# Altium schematic sheet data.SchDoc
size 297 x 209 mm
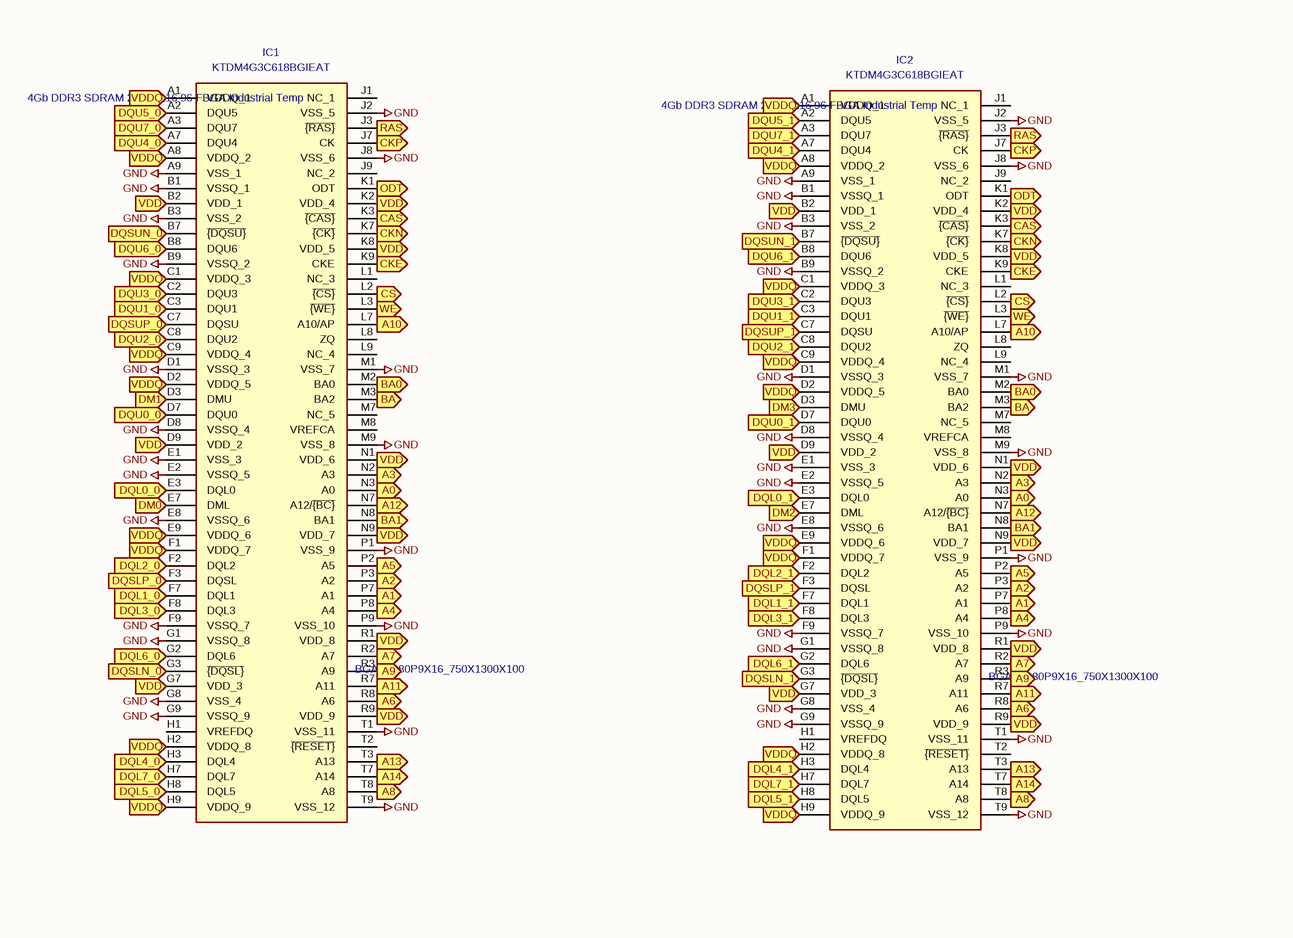
[diagram p0: data.SchDoc, top]
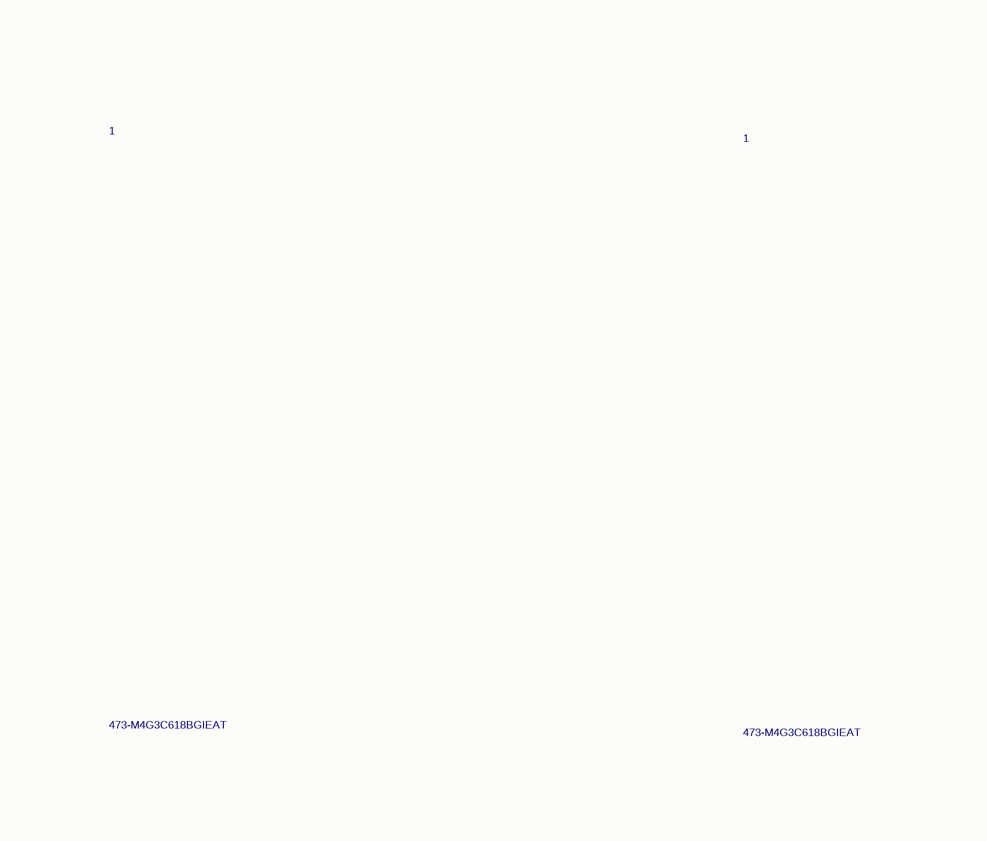
[diagram p1: data.SchDoc, centre]
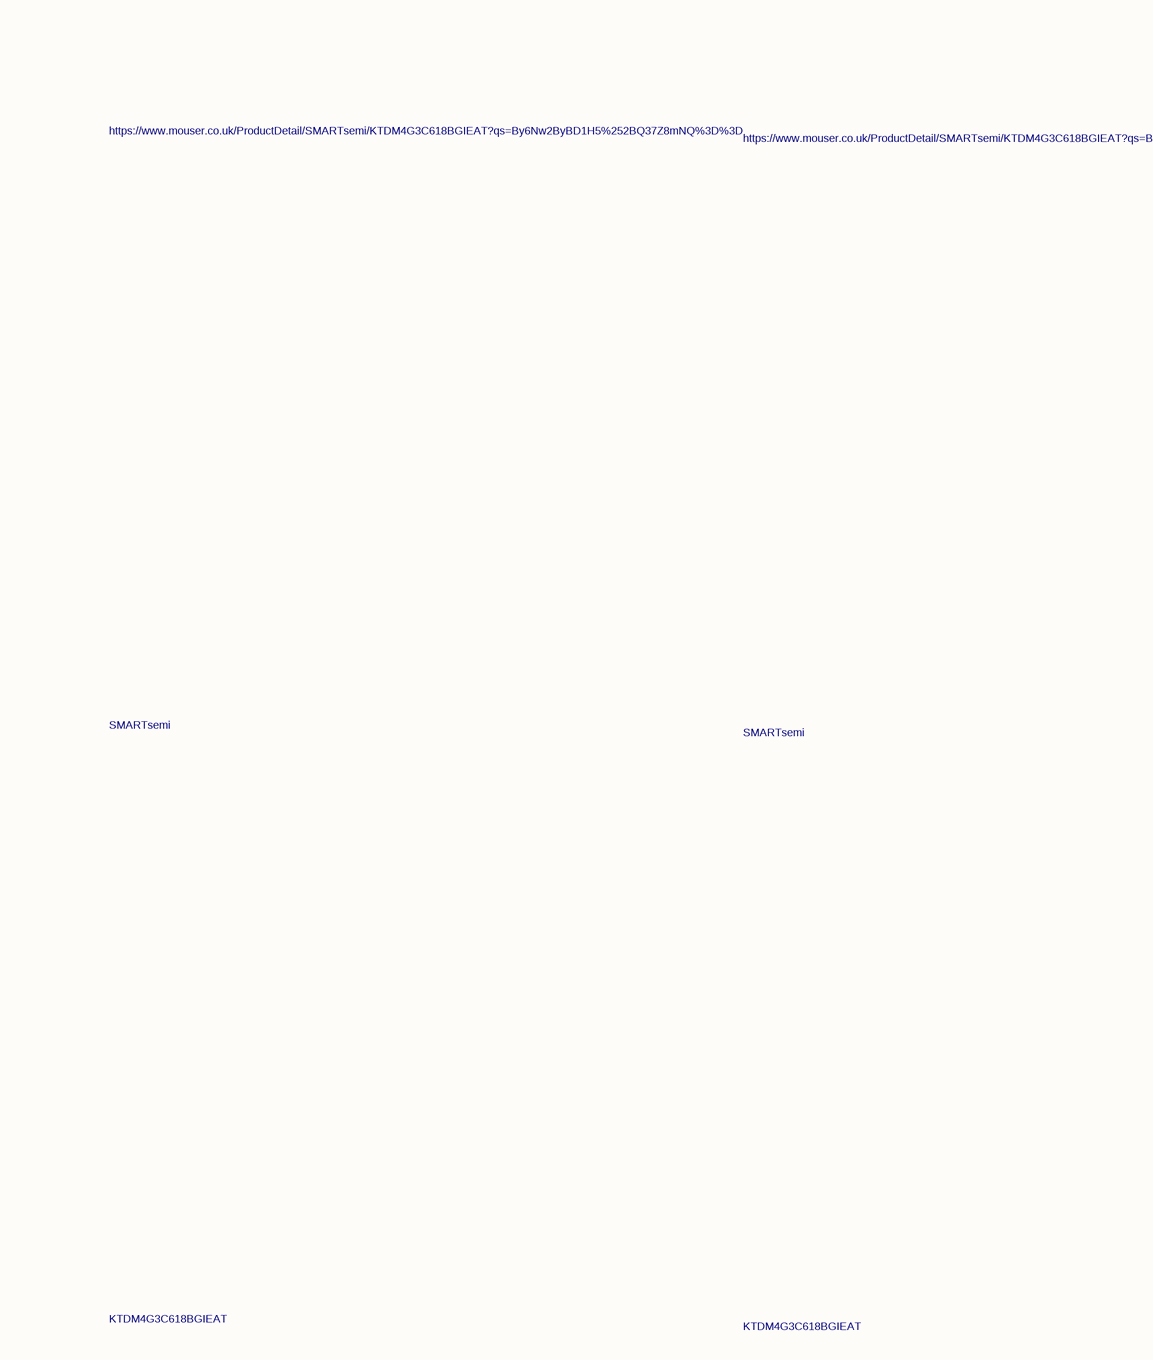
[diagram p2: data.SchDoc, bottom]

## Parts
IC1  Description: 4Gb DDR3 SDRAM 256Mbx16 96-FBGA Industrial Temp  Height: 1  Mouser Part Number: 473-M4G3C618BGIEAT  Manufacturer_Name: SMARTsemi  [BGA96C80P9X16_750X1300X100]  (hidden comment: KTDM4G3C618BGIEAT)
IC2  Description: 4Gb DDR3 SDRAM 256Mbx16 96-FBGA Industrial Temp  Height: 1  Mouser Part Number: 473-M4G3C618BGIEAT  Manufacturer_Name: SMARTsemi  [BGA96C80P9X16_750X1300X100]  (hidden comment: KTDM4G3C618BGIEAT)

## Ports
A0 (in), A1 (in), A2 (in), A3 (in), A4 (in), A5 (in), A6 (in), A7 (in), A8 (in), A9 (in), A10 (in), A11 (in), A12 (in), A13 (in), A14 (in), BA0 (in), BA1 (in), BA (in), CAS (in), CKE (in), CKN (in), CKP (in), CS (in), DM0 (in), DM1 (in), DM2 (in), DM3 (in), DQL0_0 (in), DQL0_1 (in), DQL1_0 (in), DQL1_1 (in), DQL2_0 (in), DQL2_1 (in), DQL3_0 (in), DQL3_1 (in), DQL4_0 (in), DQL4_1 (in), DQL5_0 (in), DQL5_1 (in), DQL6_0 (in), DQL6_1 (in), DQL7_0 (in), DQL7_1 (in), DQSLN_0 (in), DQSLN_1 (in), DQSLP_0 (in), DQSLP_1 (in), DQSUN_0 (in), DQSUN_1 (in), DQSUP_0 (in), DQSUP_1 (in), DQU0_0 (in), DQU0_1 (in), DQU1_0 (in), DQU1_1 (in), DQU2_0 (in), DQU2_1 (in), DQU3_0 (in), DQU3_1 (in), DQU4_0 (in), DQU4_1 (in), DQU5_0 (in), DQU5_1 (in), DQU6_0 (in), DQU6_1 (in), DQU7_0 (in), DQU7_1 (in), ODT (in), RAS (in), VDD (in), VDDQ (in), WE (in)

## Nets
GND: IC1.A9(VSS_1) IC1.B1(VSSQ_1) IC1.B3(VSS_2) IC1.B9(VSSQ_2) IC1.D1(VSSQ_3) IC1.D8(VSSQ_4) IC1.E1(VSS_3) IC1.E2(VSSQ_5) IC1.E8(VSSQ_6) IC1.F9(VSSQ_7) IC1.G1(VSSQ_8) IC1.G8(VSS_4) IC1.G9(VSSQ_9) IC1.J2(VSS_5) IC1.J8(VSS_6) IC1.M1(VSS_7) IC1.M9(VSS_8) IC1.P1(VSS_9) IC1.P9(VSS_10) IC1.T1(VSS_11) IC1.T9(VSS_12) IC2.A9(VSS_1) IC2.B1(VSSQ_1) IC2.B3(VSS_2) IC2.B9(VSSQ_2) IC2.D1(VSSQ_3) IC2.D8(VSSQ_4) IC2.E1(VSS_3) IC2.E2(VSSQ_5) IC2.E8(VSSQ_6) IC2.F9(VSSQ_7) IC2.G1(VSSQ_8) IC2.G8(VSS_4) IC2.G9(VSSQ_9) IC2.J2(VSS_5) IC2.J8(VSS_6) IC2.M1(VSS_7) IC2.M9(VSS_8) IC2.P1(VSS_9) IC2.P9(VSS_10) IC2.T1(VSS_11) IC2.T9(VSS_12)
A0: IC1.N3(A0) IC2.N3(A0) ; port A0
A1: IC1.P7(A1) IC2.P7(A1) ; port A1
A2: IC1.P3(A2) IC2.P3(A2) ; port A2
A3: IC1.N2(A3) IC2.N2(A3) ; port A3
A4: IC1.P8(A4) IC2.P8(A4) ; port A4
A5: IC1.P2(A5) IC2.P2(A5) ; port A5
A6: IC1.R8(A6) IC2.R8(A6) ; port A6
A7: IC1.R2(A7) IC2.R2(A7) ; port A7
A8: IC1.T8(A8) IC2.T8(A8) ; port A8
A9: IC1.R3(A9) IC2.R3(A9) ; port A9
A10: IC1.L7(A10/AP) IC2.L7(A10/AP) ; port A10
A11: IC1.R7(A11) IC2.R7(A11) ; port A11
A12: IC1.N7(A12/~{{BC}}) IC2.N7(A12/~{{BC}}) ; port A12
A13: IC1.T3(A13) IC2.T3(A13) ; port A13
A14: IC1.T7(A14) IC2.T7(A14) ; port A14
BA: IC1.M3(BA2) IC2.M3(BA2) ; port BA
BA0: IC1.M2(BA0) IC2.M2(BA0) ; port BA0
BA1: IC1.N8(BA1) IC2.N8(BA1) ; port BA1
CAS: IC1.K3(~{{CAS}}) IC2.K3(~{{CAS}}) ; port CAS
CKE: IC1.K9(CKE) IC2.K9(CKE) ; port CKE
CKN: IC1.K7(~{{CK}}) IC2.K7(~{{CK}}) ; port CKN
CKP: IC1.J7(CK) IC2.J7(CK) ; port CKP
CS: IC1.L2(~{{CS}}) IC2.L2(~{{CS}}) ; port CS
DM0: IC1.E7(DML) ; port DM0
DM1: IC1.D3(DMU) ; port DM1
DM2: IC2.E7(DML) ; port DM2
DM3: IC2.D3(DMU) ; port DM3
DQL0_0: IC1.E3(DQL0) ; port DQL0_0
DQL0_1: IC2.E3(DQL0) ; port DQL0_1
DQL1_0: IC1.F7(DQL1) ; port DQL1_0
DQL1_1: IC2.F7(DQL1) ; port DQL1_1
DQL2_0: IC1.F2(DQL2) ; port DQL2_0
DQL2_1: IC2.F2(DQL2) ; port DQL2_1
DQL3_0: IC1.F8(DQL3) ; port DQL3_0
DQL3_1: IC2.F8(DQL3) ; port DQL3_1
DQL4_0: IC1.H3(DQL4) ; port DQL4_0
DQL4_1: IC2.H3(DQL4) ; port DQL4_1
DQL5_0: IC1.H8(DQL5) ; port DQL5_0
DQL5_1: IC2.H8(DQL5) ; port DQL5_1
DQL6_0: IC1.G2(DQL6) ; port DQL6_0
DQL6_1: IC2.G2(DQL6) ; port DQL6_1
DQL7_0: IC1.H7(DQL7) ; port DQL7_0
DQL7_1: IC2.H7(DQL7) ; port DQL7_1
DQSLN_0: IC1.G3(~{{DQSL}}) ; port DQSLN_0
DQSLN_1: IC2.G3(~{{DQSL}}) ; port DQSLN_1
DQSLP_0: IC1.F3(DQSL) ; port DQSLP_0
DQSLP_1: IC2.F3(DQSL) ; port DQSLP_1
DQSUN_0: IC1.B7(~{{DQSU}}) ; port DQSUN_0
DQSUN_1: IC2.B7(~{{DQSU}}) ; port DQSUN_1
DQSUP_0: IC1.C7(DQSU) ; port DQSUP_0
DQSUP_1: IC2.C7(DQSU) ; port DQSUP_1
DQU0_0: IC1.D7(DQU0) ; port DQU0_0
DQU0_1: IC2.D7(DQU0) ; port DQU0_1
DQU1_0: IC1.C3(DQU1) ; port DQU1_0
DQU1_1: IC2.C3(DQU1) ; port DQU1_1
DQU2_0: IC1.C8(DQU2) ; port DQU2_0
DQU2_1: IC2.C8(DQU2) ; port DQU2_1
DQU3_0: IC1.C2(DQU3) ; port DQU3_0
DQU3_1: IC2.C2(DQU3) ; port DQU3_1
DQU4_0: IC1.A7(DQU4) ; port DQU4_0
DQU4_1: IC2.A7(DQU4) ; port DQU4_1
DQU5_0: IC1.A2(DQU5) ; port DQU5_0
DQU5_1: IC2.A2(DQU5) ; port DQU5_1
DQU6_0: IC1.B8(DQU6) ; port DQU6_0
DQU6_1: IC2.B8(DQU6) ; port DQU6_1
DQU7_0: IC1.A3(DQU7) ; port DQU7_0
DQU7_1: IC2.A3(DQU7) ; port DQU7_1
ODT: IC1.K1(ODT) IC2.K1(ODT) ; port ODT
RAS: IC1.J3(~{{RAS}}) IC2.J3(~{{RAS}}) ; port RAS
VDD: IC1.B2(VDD_1) IC1.D9(VDD_2) IC1.G7(VDD_3) IC1.K2(VDD_4) IC1.K8(VDD_5) IC1.N1(VDD_6) IC1.N9(VDD_7) IC1.R1(VDD_8) IC1.R9(VDD_9) IC2.B2(VDD_1) IC2.D9(VDD_2) IC2.G7(VDD_3) IC2.K2(VDD_4) IC2.K8(VDD_5) IC2.N1(VDD_6) IC2.N9(VDD_7) IC2.R1(VDD_8) IC2.R9(VDD_9) ; port VDD
VDDQ: IC1.A1(VDDQ_1) IC1.A8(VDDQ_2) IC1.C1(VDDQ_3) IC1.C9(VDDQ_4) IC1.D2(VDDQ_5) IC1.E9(VDDQ_6) IC1.F1(VDDQ_7) IC1.H2(VDDQ_8) IC1.H9(VDDQ_9) IC2.A1(VDDQ_1) IC2.A8(VDDQ_2) IC2.C1(VDDQ_3) IC2.C9(VDDQ_4) IC2.D2(VDDQ_5) IC2.E9(VDDQ_6) IC2.F1(VDDQ_7) IC2.H2(VDDQ_8) IC2.H9(VDDQ_9) ; port VDDQ
WE: IC1.L3(~{{WE}}) IC2.L3(~{{WE}}) ; port WE

Not connected (* = marked no-connect by the designer): IC1 H1(VREFDQ) J1(NC_1) J9(NC_2) L1(NC_3) L8(ZQ) L9(NC_4) M7(NC_5) M8(VREFCA) T2(~{{RESET}}); IC2 H1(VREFDQ) J1(NC_1) J9(NC_2) L1(NC_3) L8(ZQ) L9(NC_4) M7(NC_5) M8(VREFCA) T2(~{{RESET}})

## Notes on the sheet
- 1
- 2
- 3
- 4
- 5
- 6
- A
- B
- C
- D
- Title:
- File: data.kicad_sch
- Sheet: /
- KiCad E.D.A.  kicad (5.1.4)-1
- Size: A4
- Date:
- Rev:
- Id: 1/1

## Library data of the parts
IC1 IC2 = KTDM4G3C618BGIEAT: Mouser Price/Stock: https://www.mouser.co.uk/ProductDetail/SMARTsemi/KTDM4G3C618BGIEAT?qs=By6Nw2ByBD1H5%252BQ37Z8mNQ%3D%3D; Manufacturer_Part_Number: KTDM4G3C618BGIEAT; Value: KTDM4G3C618BGIEAT